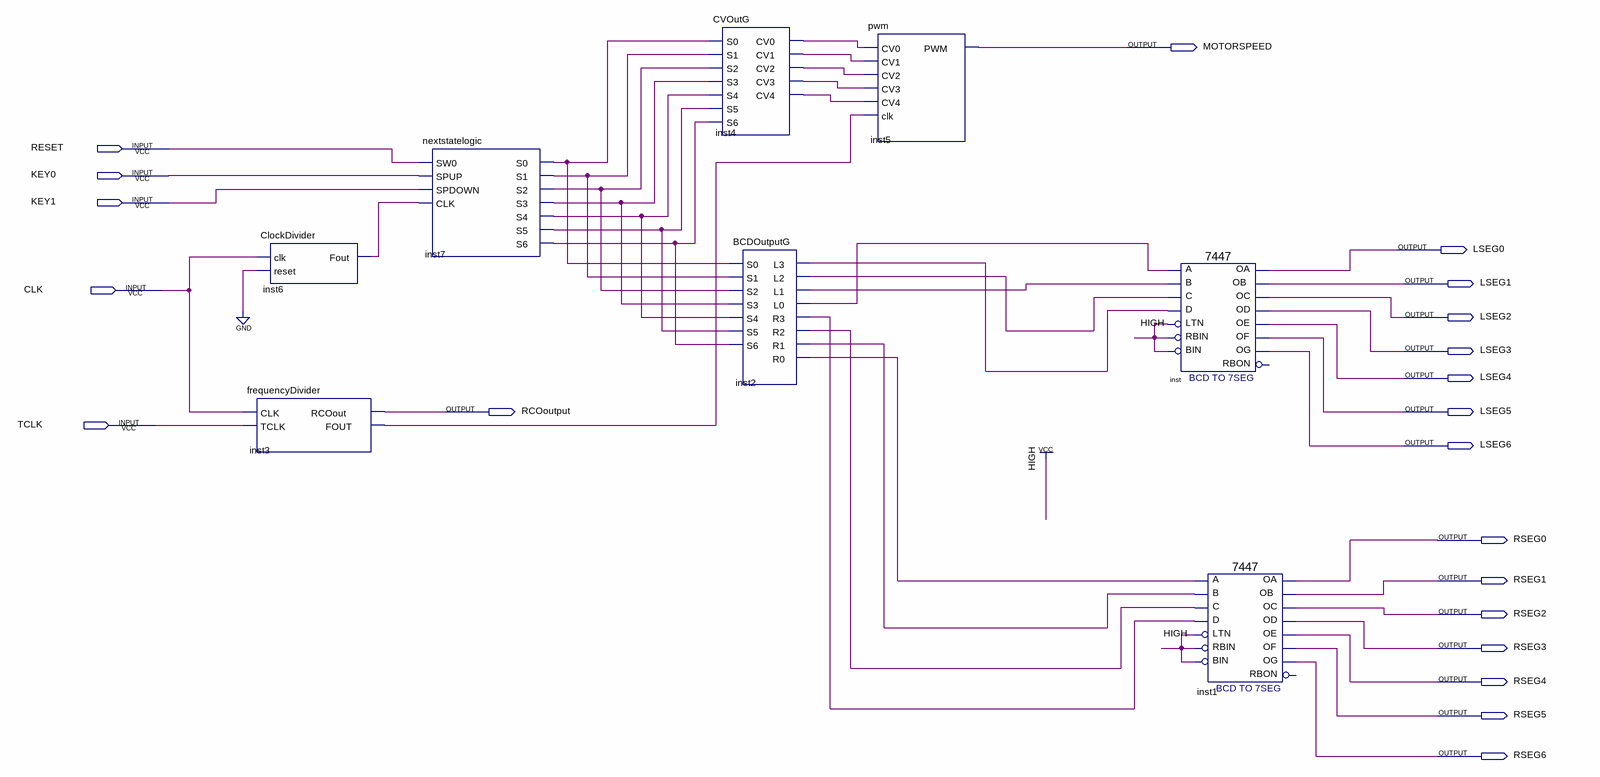
[diagram p0: schematic sheet]
// Quartus schematic motorcontroller.bdf as structural Verilog: 8 symbols, 21 pins
module motorcontroller (
  input  RESET,
  input  KEY0,
  input  KEY1,
  input  CLK,
  input  TCLK,
  output MOTORSPEED,
  output LSEG0,
  output LSEG1,
  output LSEG2,
  output LSEG3,
  output LSEG4,
  output RCOoutput,
  output LSEG5,
  output LSEG6,
  output RSEG0,
  output RSEG1,
  output RSEG2,
  output RSEG3,
  output RSEG4,
  output RSEG5,
  output RSEG6
);

  wire inst2_l0, inst2_l1, inst2_l2, inst2_l3, inst2_r0, inst2_r1, inst2_r2, inst2_r3, inst3_fout, inst4_cv0,
       inst4_cv1, inst4_cv2, inst4_cv3, inst4_cv4, inst6_fout, inst7_s0, inst7_s1, inst7_s2, inst7_s3,
       inst7_s4, inst7_s5, inst7_s6;

  ClockDivider inst6 (.clk(CLK), .reset(1'b0), .Fout(inst6_fout));
  frequencyDivider inst3 (.CLK(CLK), .TCLK(TCLK), .RCOout(RCOoutput), .FOUT(inst3_fout));
  nextstatelogic inst7 (
    .SW0(RESET), .SPUP(KEY0), .SPDOWN(KEY1), .CLK(inst6_fout), .S0(inst7_s0), .S1(inst7_s1), .S2(inst7_s2),
    .S3(inst7_s3), .S4(inst7_s4), .S5(inst7_s5), .S6(inst7_s6));
  CVOutG inst4 (
    .S0(inst7_s0), .S1(inst7_s1), .S2(inst7_s2), .S3(inst7_s3), .S4(inst7_s4), .S5(inst7_s5), .S6(inst7_s6),
    .CV0(inst4_cv0), .CV1(inst4_cv1), .CV2(inst4_cv2), .CV3(inst4_cv3), .CV4(inst4_cv4));
  BCDOutputG inst2 (
    .S0(inst7_s0), .S1(inst7_s1), .S2(inst7_s2), .S3(inst7_s3), .S4(inst7_s4), .S5(inst7_s5), .S6(inst7_s6),
    .L3(inst2_l3), .L2(inst2_l2), .L1(inst2_l1), .L0(inst2_l0), .R3(inst2_r3), .R2(inst2_r2), .R1(inst2_r1),
    .R0(inst2_r0));
  pwm inst5 (
    .CV0(inst4_cv0), .CV1(inst4_cv1), .CV2(inst4_cv2), .CV3(inst4_cv3), .CV4(inst4_cv4), .clk(inst3_fout),
    .PWM(MOTORSPEED));
  \7447  inst (
    .LTN(1'b1), .B(inst2_l1), .C(inst2_l2), .D(inst2_l3), .RBIN(1'b1), .BIN(1'b1), .A(inst2_l0), .OB(LSEG1),
    .OC(LSEG2), .OE(LSEG4), .OD(LSEG3), .OF(LSEG5), .OG(LSEG6), .OA(LSEG0));  // open: RBON
  \7447  inst1 (
    .LTN(1'b1), .B(inst2_r1), .C(inst2_r2), .D(inst2_r3), .RBIN(1'b1), .BIN(1'b1), .A(inst2_r0), .OB(RSEG1),
    .OC(RSEG2), .OE(RSEG4), .OD(RSEG3), .OF(RSEG5), .OG(RSEG6), .OA(RSEG0));  // open: RBON
endmodule
